# Altium schematic sheet GPIO Direct.SchDoc
size 381 x 241 mm
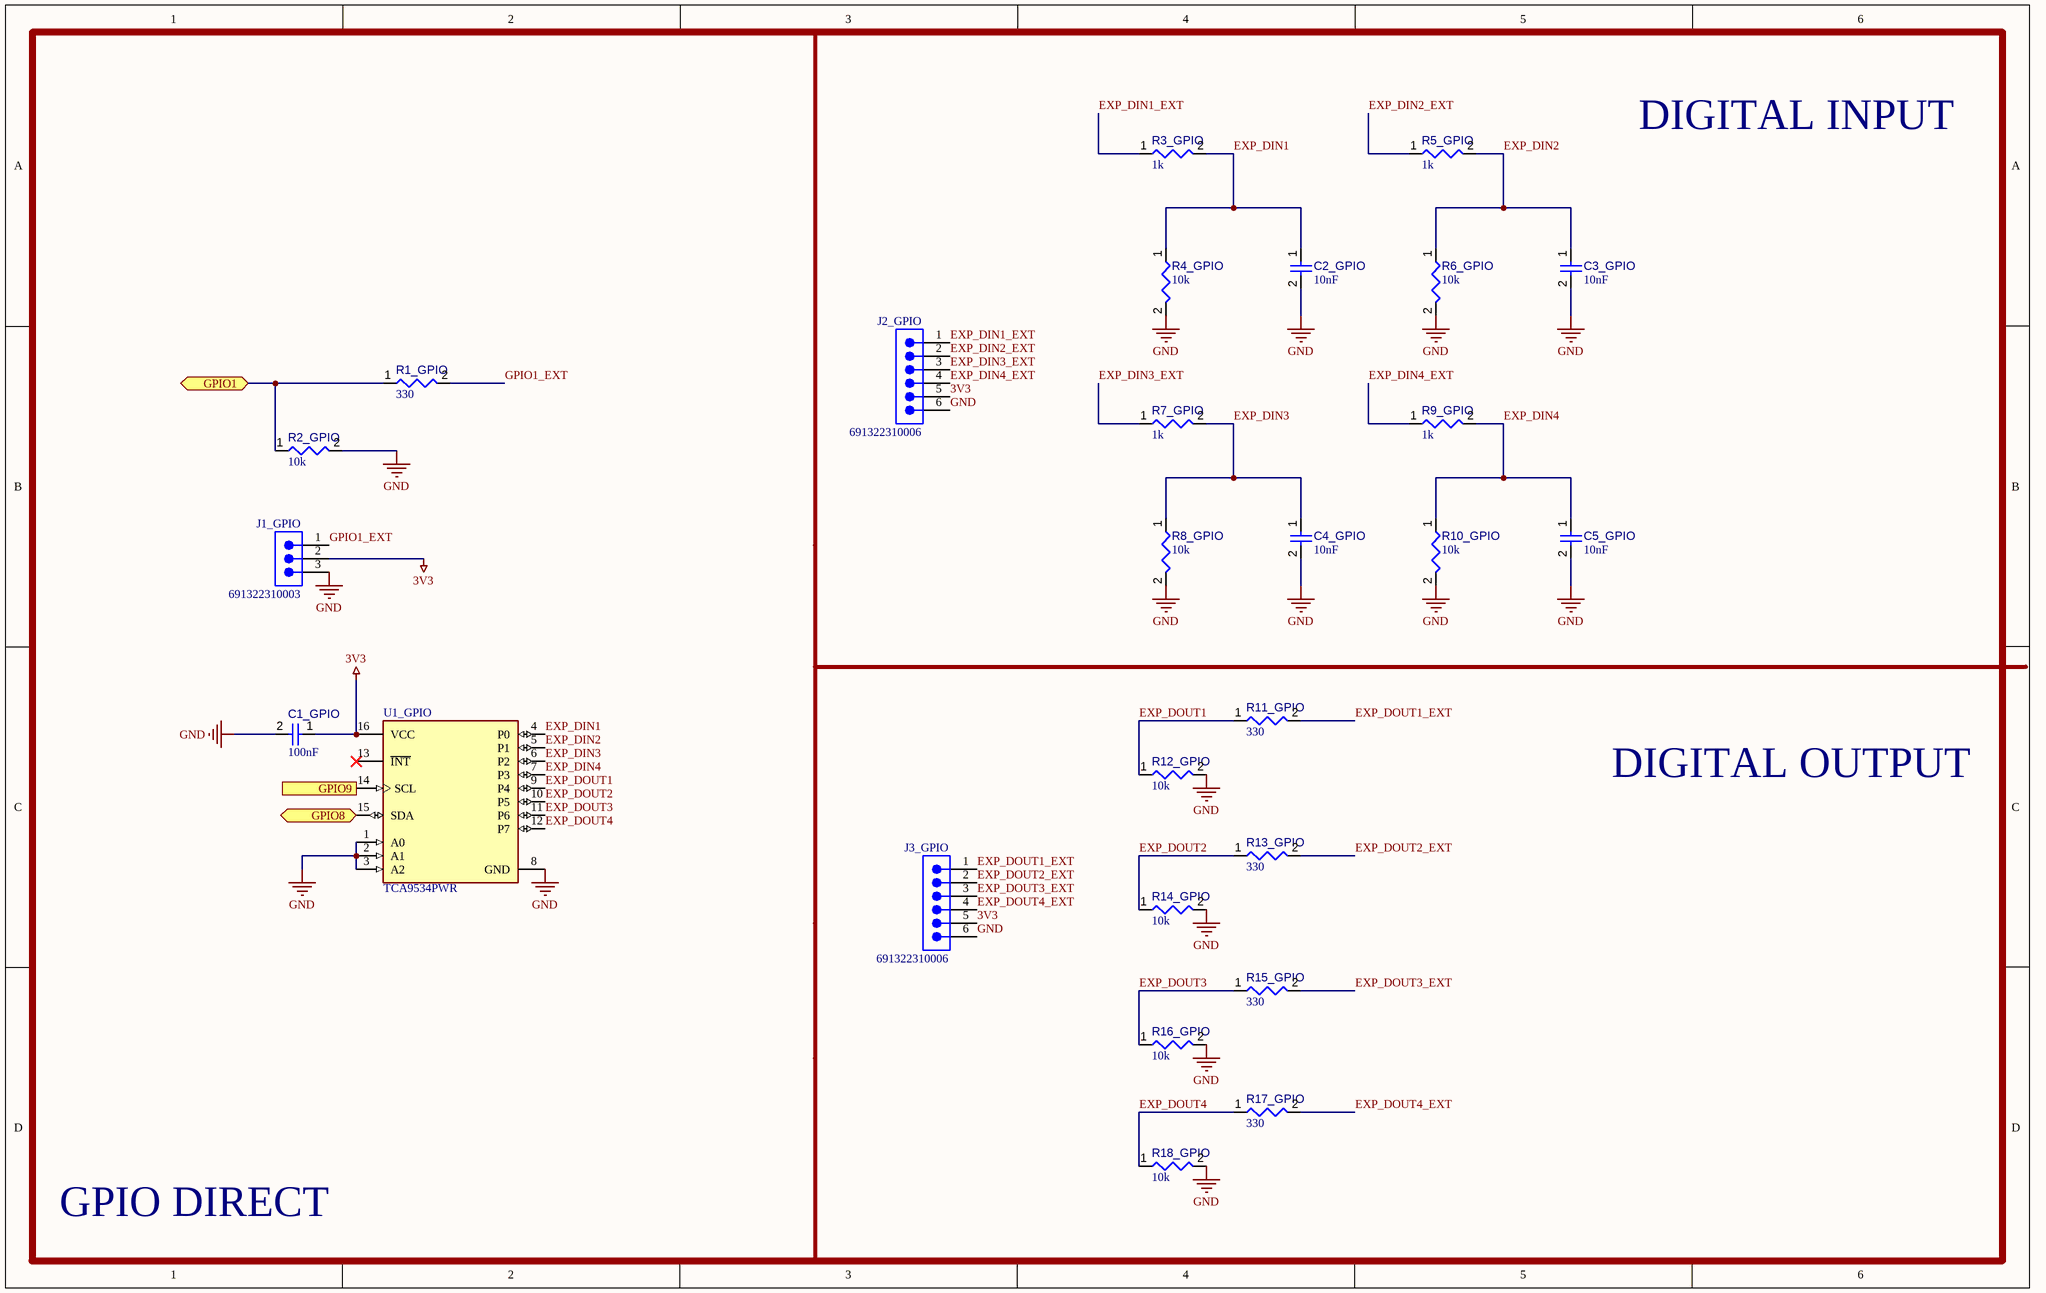
[diagram p0: GPIO Direct.SchDoc]

## Parts
C1_GPIO  value 100nF  [CAPC1608X90X40NL10T20]  (hidden comment: Capacitor 100 nF +/-10% 50 V 0603)
C2_GPIO  value 10nF  [CAPC0402(1005)60_L]  (hidden comment: Capacitor 10nF +/-20% 50V 0402)
C3_GPIO  value 10nF  [CAPC0402(1005)60_L]  (hidden comment: Capacitor 10nF +/-20% 50V 0402)
C4_GPIO  value 10nF  [CAPC0402(1005)60_L]  (hidden comment: Capacitor 10nF +/-20% 50V 0402)
C5_GPIO  value 10nF  [CAPC0402(1005)60_L]  (hidden comment: Capacitor 10nF +/-20% 50V 0402)
J1_GPIO  691322310003  [691322310003]
J2_GPIO  691322310006  [691322310006]
J3_GPIO  691322310006  [691322310006]
R1_GPIO  value 330  [RESC0402(1005)_L]  (hidden comment: Resistor 330R +/-5 % 0402 63 mW)
R2_GPIO  value 10k  [RESC0402(1005)_L]  (hidden comment: Resistor 10K  +/-1 % 0402 63 mW)
R3_GPIO  value 1k  [RESC1608X55X25ML10T15]  (hidden comment: Resistor 1k +/-1% 0603 100 mW)
R4_GPIO  value 10k  [RESC1005X40X25ML05T05]  (hidden comment: Resistor 10k +/-1% 0402 63 mW)
R5_GPIO  value 1k  [RESC1608X55X25ML10T15]  (hidden comment: Resistor 1k +/-1% 0603 100 mW)
R6_GPIO  value 10k  [RESC1005X40X25ML05T05]  (hidden comment: Resistor 10k +/-1% 0402 63 mW)
R7_GPIO  value 1k  [RESC1608X55X25ML10T15]  (hidden comment: Resistor 1k +/-1% 0603 100 mW)
R8_GPIO  value 10k  [RESC1005X40X25ML05T05]  (hidden comment: Resistor 10k +/-1% 0402 63 mW)
R9_GPIO  value 1k  [RESC1608X55X25ML10T15]  (hidden comment: Resistor 1k +/-1% 0603 100 mW)
R10_GPIO  value 10k  [RESC1005X40X25ML05T05]  (hidden comment: Resistor 10k +/-1% 0402 63 mW)
R11_GPIO  value 330  [RESC0402(1005)_L]  (hidden comment: Resistor 330R +/-5 % 0402 63 mW)
R12_GPIO  value 10k  [RESC0402(1005)_L]  (hidden comment: Resistor 10K  +/-1 % 0402 63 mW)
R13_GPIO  value 330  [RESC0402(1005)_L]  (hidden comment: Resistor 330R +/-5 % 0402 63 mW)
R14_GPIO  value 10k  [RESC0402(1005)_L]  (hidden comment: Resistor 10K  +/-1 % 0402 63 mW)
R15_GPIO  value 330  [RESC0402(1005)_L]  (hidden comment: Resistor 330R +/-5 % 0402 63 mW)
R16_GPIO  value 10k  [RESC0402(1005)_L]  (hidden comment: Resistor 10K  +/-1 % 0402 63 mW)
R17_GPIO  value 330  [RESC0402(1005)_L]  (hidden comment: Resistor 330R +/-5 % 0402 63 mW)
R18_GPIO  value 10k  [RESC0402(1005)_L]  (hidden comment: Resistor 10K  +/-1 % 0402 63 mW)
U1_GPIO  TCA9534PWR  [FP-PW0016A-IPC_B]

## Ports
GPIO1 (bidir), GPIO8 (bidir), GPIO9 (in)

## Nets
3V3: C1_GPIO.1 J1_GPIO.2 J2_GPIO.5 J3_GPIO.5 U1_GPIO.16(VCC)
GND: C1_GPIO.2 C2_GPIO.2 C3_GPIO.2 C4_GPIO.2 C5_GPIO.2 J1_GPIO.3 J2_GPIO.6 J3_GPIO.6 R2_GPIO.2 R4_GPIO.2 R6_GPIO.2 R8_GPIO.2 R10_GPIO.2 R12_GPIO.2 R14_GPIO.2 R16_GPIO.2 R18_GPIO.2 U1_GPIO.1(A0) U1_GPIO.2(A1) U1_GPIO.3(A2) U1_GPIO.8(GND)
EXP_DIN1: C2_GPIO.1 R3_GPIO.2 R4_GPIO.1 U1_GPIO.4(P0)
EXP_DIN1_EXT: J2_GPIO.1 R3_GPIO.1
EXP_DIN2: C3_GPIO.1 R5_GPIO.2 R6_GPIO.1 U1_GPIO.5(P1)
EXP_DIN2_EXT: J2_GPIO.2 R5_GPIO.1
EXP_DIN3: C4_GPIO.1 R7_GPIO.2 R8_GPIO.1 U1_GPIO.6(P2)
EXP_DIN3_EXT: J2_GPIO.3 R7_GPIO.1
EXP_DIN4: C5_GPIO.1 R9_GPIO.2 R10_GPIO.1 U1_GPIO.7(P3)
EXP_DIN4_EXT: J2_GPIO.4 R9_GPIO.1
EXP_DOUT1: R11_GPIO.1 R12_GPIO.1 U1_GPIO.9(P4)
EXP_DOUT1_EXT: J3_GPIO.1 R11_GPIO.2
EXP_DOUT2: R13_GPIO.1 R14_GPIO.1 U1_GPIO.10(P5)
EXP_DOUT2_EXT: J3_GPIO.2 R13_GPIO.2
EXP_DOUT3: R15_GPIO.1 R16_GPIO.1 U1_GPIO.11(P6)
EXP_DOUT3_EXT: J3_GPIO.3 R15_GPIO.2
EXP_DOUT4: R17_GPIO.1 R18_GPIO.1 U1_GPIO.12(P7)
EXP_DOUT4_EXT: J3_GPIO.4 R17_GPIO.2
GPIO1: R1_GPIO.1 R2_GPIO.1 ; port GPIO1
GPIO1_EXT: J1_GPIO.1 R1_GPIO.2
GPIO8: U1_GPIO.15(SDA) ; port GPIO8
GPIO9: U1_GPIO.14(SCL) ; port GPIO9

Not connected (* = marked no-connect by the designer): U1_GPIO 13(~{INT})*

## Notes on the sheet
- DIGITAL INPUT
- DIGITAL OUTPUT
- GPIO DIRECT

## Library data of the parts
C1_GPIO = CMP-001-00017-6: Chip Capacitor, 100 nF, +/- 10%, 50 V, 0603 (1608 Metric); Voltage Rating: 50V; Capacitor Type: Ceramic; Tolerance: 10%; Mounting Technology: SM; Max Operating Temperature: 125°C; RoHS Compliant: True; Pins: 2; Case/Package: 0603; Min Operating Temperature: -55°C
C2_GPIO C3_GPIO C4_GPIO C5_GPIO = CMP-001-00069-3: Chip Capacitor, 10nF +/-20%, 50V, 0402, Thickness 0.6 mm; Tolerance: 5%; Max Operating Temperature: 85°C; Pins: 2; Case/Package: 0402; Voltage Rating: 50V; Min Operating Temperature: -55°C; Mounting Technology: SMT
J1_GPIO = CMP-002-00075-1: Wurth Elektronik 3.81mmpitch3pPlug-in terminal blocks socket head, 322series, 300.0 v, welding; Manufacturer Lifecycle Status: ACTIVE; Gender: Male; Current: 10A; Number of Positions Per Level: 3; YEOL: 1 = Estimated lifetime > 10 years; Voltage: 300V; Number of Levels: 1; Pitch: 3.81mm; Contact Plating: Tin; Packaging: Box; Height: 7.2mm; Color: Green; Pins: 3; Max Operating Temperature: 105°C; Length: 12.62mm; Width: 12.82mm; Voltage Rating: 300V; Min Operating Temperature: -40°C; RoHS: Compliant; Lifecycle Status: Production; Current Rating: 10A; Lead Pitch: 3.81mm; Contact Material: Tin; Mounting Technology: Through Hole; Number of Contacts: 3; Number of Rows: 1; Termination: Solder
J2_GPIO J3_GPIO = CMP-002-00076-1: Wurth Elektronik 3.81mmpitch6pPlug-in terminal blocks socket head, 322series, 300.0 v, welding; Manufacturer Lifecycle Status: ACTIVE; Current: 10A; Number of Contacts: 6; Pitch: 3.81mm; Number of Levels: 1; YEOL: 1 = Estimated lifetime > 10 years; Gender: Male; Voltage: 300V; Contact Plating: Tin; Number of Positions Per Level: 6; Width: 24.25mm; Color: Green; Length: 24.05mm; Packaging: Box; Number of Rows: 1; Contact Material: Brass; Max Operating Temperature: 105°C; Mounting Technology: Through Hole; RoHS: Compliant; REACH SVHC: No; Height: 9.2mm; Lead Pitch: 3.81mm; Termination: Solder; Pins: 6; Lifecycle Status: Production; Min Operating Temperature: -40°C
R1_GPIO R11_GPIO R13_GPIO R15_GPIO R17_GPIO = CMP-009-00132-3: Chip Resistor, 330 Ohms, +/-5 %, 63 mW, -55 to 155 degC, 0402; Power: 63mW; Tolerance: 5%; Pins: 2; Max Operating Temperature: 155°C; Min Operating Temperature: -55°C; Case/Package: 0402
R2_GPIO R12_GPIO R14_GPIO R16_GPIO R18_GPIO = CMP-009-00149-3: Chip Resistor, 10 kOhms, +/-1 %, 63 mW, -55 to 125 degC, 0402; Power: 63mW; Tolerance: 1%; Min Operating Temperature: -55°C; Case/Package: 0402; Max Operating Temperature: 155°C; Pins: 2
R3_GPIO R5_GPIO R7_GPIO R9_GPIO = CMP-009-00014-5: Chip Resistor, 1 KOhm, +/-1%, 0.1 W, -55 to 155 degC, 0603 (1608 Metric); Voltage Rating: 50V; Power: 100mW; Tolerance: 1%; Mounting Technology: SM; Pins: 2; Case/Package: 0603; Min Operating Temperature: -55°C; RoHS Compliant: True; Max Operating Temperature: 155°C
R4_GPIO R6_GPIO R8_GPIO R10_GPIO = CMP-009-00019-5: Chip Resistor, 10 KOhm, +/- 1%, 63 mW, -55 to 155 degC, 0402 (1005 Metric); Power: 63mW; Voltage Rating: 50V; Case/Package: 0402; Mounting Technology: SM; Pins: 2; Min Operating Temperature: -55°C; Tolerance: 1%; RoHS Compliant: True; Max Operating Temperature: 155°C
U1_GPIO = CMP-031-00008-1: 10mA 25mA I2C 8 1.65V 5.5V 400KHz yes TSSOP-16 SMD mount，glue mount 1.2mm(height); Manufacturer Lifecycle Status: ACTIVE; Max Junction Temperature (Tj): 100°C; Number of I/Os: 8; Frequency: 400kHz; Max Operating Temperature: 85°C; Width: 4.4mm; Packaging: Cut Tape (CT); Height: 1.2mm; Mounting Technology: Surface Mount; Min Supply Voltage: 1.65V; Min Operating Temperature: -40°C; Pins: 16; Ambient Temperature Range High: 85°C; Lead Free: Lead Free; Schedule B: 8542390000, 8542390000; Length: 5mm; Max Supply Voltage: 5.5V; Interface: I2C; Number of Channels: 8; Lifecycle Status: Production; Number of Outputs: 8; Thickness: 1mm; Case/Package: TSSOP; RoHS: Compliant